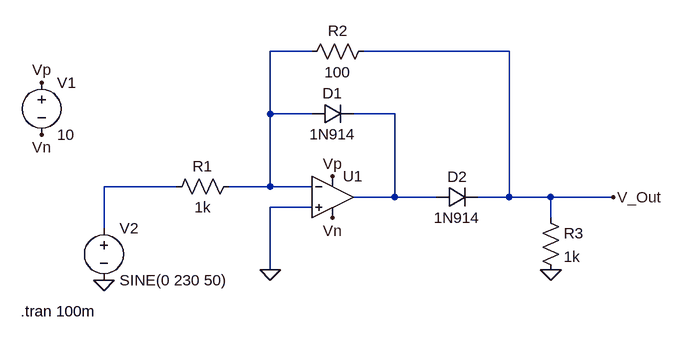
[diagram p0: schematic Precision_Rectifier.asc]
Precision_Rectifier.asc, the LTspice schematic file:
Version 4.1
SHEET 1 880 680
WIRE 160 -80 96 -80
WIRE 464 -80 240 -80
WIRE 96 16 96 -80
WIRE 160 16 96 16
WIRE 288 16 224 16
WIRE -48 128 -160 128
WIRE 96 128 96 16
WIRE 96 128 32 128
WIRE 160 128 96 128
WIRE 288 144 288 16
WIRE 288 144 224 144
WIRE 352 144 288 144
WIRE 464 144 464 -80
WIRE 464 144 416 144
WIRE 528 144 464 144
WIRE 624 144 528 144
WIRE 160 160 96 160
WIRE 528 176 528 144
WIRE -160 192 -160 128
WIRE 96 256 96 160
FLAG -256 -32 Vp
FLAG 192 112 Vp
FLAG -256 48 Vn
FLAG 192 176 Vn
FLAG -160 272 0
FLAG 528 256 0
FLAG 624 144 V_Out
FLAG 96 256 0
SYMBOL OpAmps\\UniversalOpAmp2 192 144 R0
SYMATTR InstName U1
SYMBOL voltage -256 -48 R0
WINDOW 123 0 0 Left 0
WINDOW 39 0 0 Left 0
SYMATTR InstName V1
SYMATTR Value 10
SYMBOL voltage -160 176 R0
WINDOW 123 24 124 Left 2
WINDOW 39 0 0 Left 0
SYMATTR InstName V2
SYMATTR Value SINE(0 230 50)
SYMBOL res 48 112 R90
WINDOW 0 0 56 VBottom 2
WINDOW 3 32 56 VTop 2
SYMATTR InstName R1
SYMATTR Value 1k
SYMBOL res 256 -96 R90
WINDOW 0 0 56 VBottom 2
WINDOW 3 32 56 VTop 2
SYMATTR InstName R2
SYMATTR Value 100
SYMBOL diode 160 32 R270
WINDOW 0 32 32 VTop 2
WINDOW 3 0 32 VBottom 2
SYMATTR InstName D1
SYMATTR Value 1N914
SYMBOL diode 352 160 R270
WINDOW 0 32 32 VTop 2
WINDOW 3 0 32 VBottom 2
SYMATTR InstName D2
SYMATTR Value 1N914
SYMBOL res 512 160 R0
SYMATTR InstName R3
SYMATTR Value 1k
TEXT -288 320 Left 2 !.tran 100m

The netlist it stands for:
* Precision_Rectifier.asc
X§U1 0 N001 Vp Vn N002 level2 Avol=1Meg GBW=10Meg Slew=10Meg Ilimit=25m Rail=0 Vos=0 En=0 Enk=0 In=0 Ink=0 Rin=500Meg  ; pins In+ In- V+ V- OUT
V1 Vp Vn 10
V2 N003 0 SINE(0 230 50)
R1 N001 N003 1k
R2 V_Out N001 100
D1 N001 N002 1N914
D2 N002 V_Out 1N914
R3 V_Out 0 1k
.model D D
.lib standard.dio
.tran 100m
.lib UniversalOpAmp2.lib
.backanno
.end